# Altium schematic sheet SRAM.SchDoc
size A; SheetNumber: 4; SheetTotal: 10
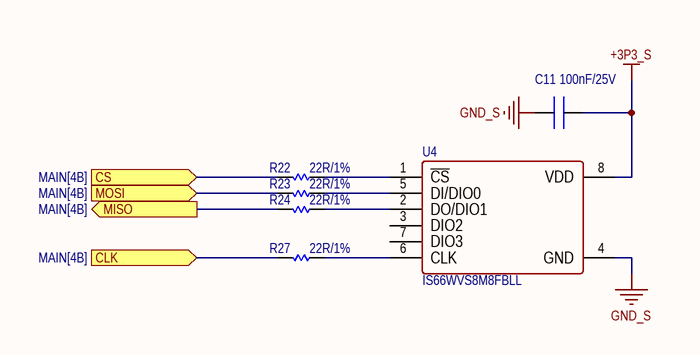
[diagram p0: SRAM.SchDoc]

## Parts
C11  100nF/25V  [CN-SMD-0603]
R22  22R/1%  [RES-SMD-0603]
R23  22R/1%  [RES-SMD-0603]
R24  22R/1%  [RES-SMD-0603]
R27  22R/1%  [RES-SMD-0603]
U4  IS66WVS8M8FBLL  [SO8]

## Ports
CLK (in, see MAIN[4B]), CS (in, see MAIN[4B]), MISO (out, see MAIN[4B]), MOSI (in, see MAIN[4B])

## Nets
+3P3_S: C11.2 U4.8(VDD)
GND_S: C11.1 U4.4(GND)
CLK: R27.2 ; port CLK
CS: R22.2 ; port CS
MISO: R24.2 ; port MISO
MOSI: R23.2 ; port MOSI
NetR22_1: R22.1 U4.1(~{CS})
NetR23_1: R23.1 U4.5(DI/DIO0)
NetR24_1: R24.1 U4.2(DO/DIO1)
NetR27_1: R27.1 U4.6(CLK)

Not connected (* = marked no-connect by the designer): U4 3(DIO2) 7(DIO3)

## Library data of the parts
C11 = CN: CL10B104KA8NNNC; PN: CL10B104KA8NNNC
R22-R24 R27 = Res-SMD: ERJ-3EKF22R0V; Manufacturer: Generic Components; Class: Passive; PN: ERJ-3EKF22R0V; Publisher: Altium Hobart Technology Centre
U4 = IS66WVS8M8FBLL: 64Mb SerialRAM 1.8V/3.0V, 104MHZ, SPI & QPI PROTOCOL; PN: IS66WVS8M8FBLL